# EAGLE schematic OmnibusB (EAGLE 6.6.0), part 2 of 2
## Sheet 4 of 4
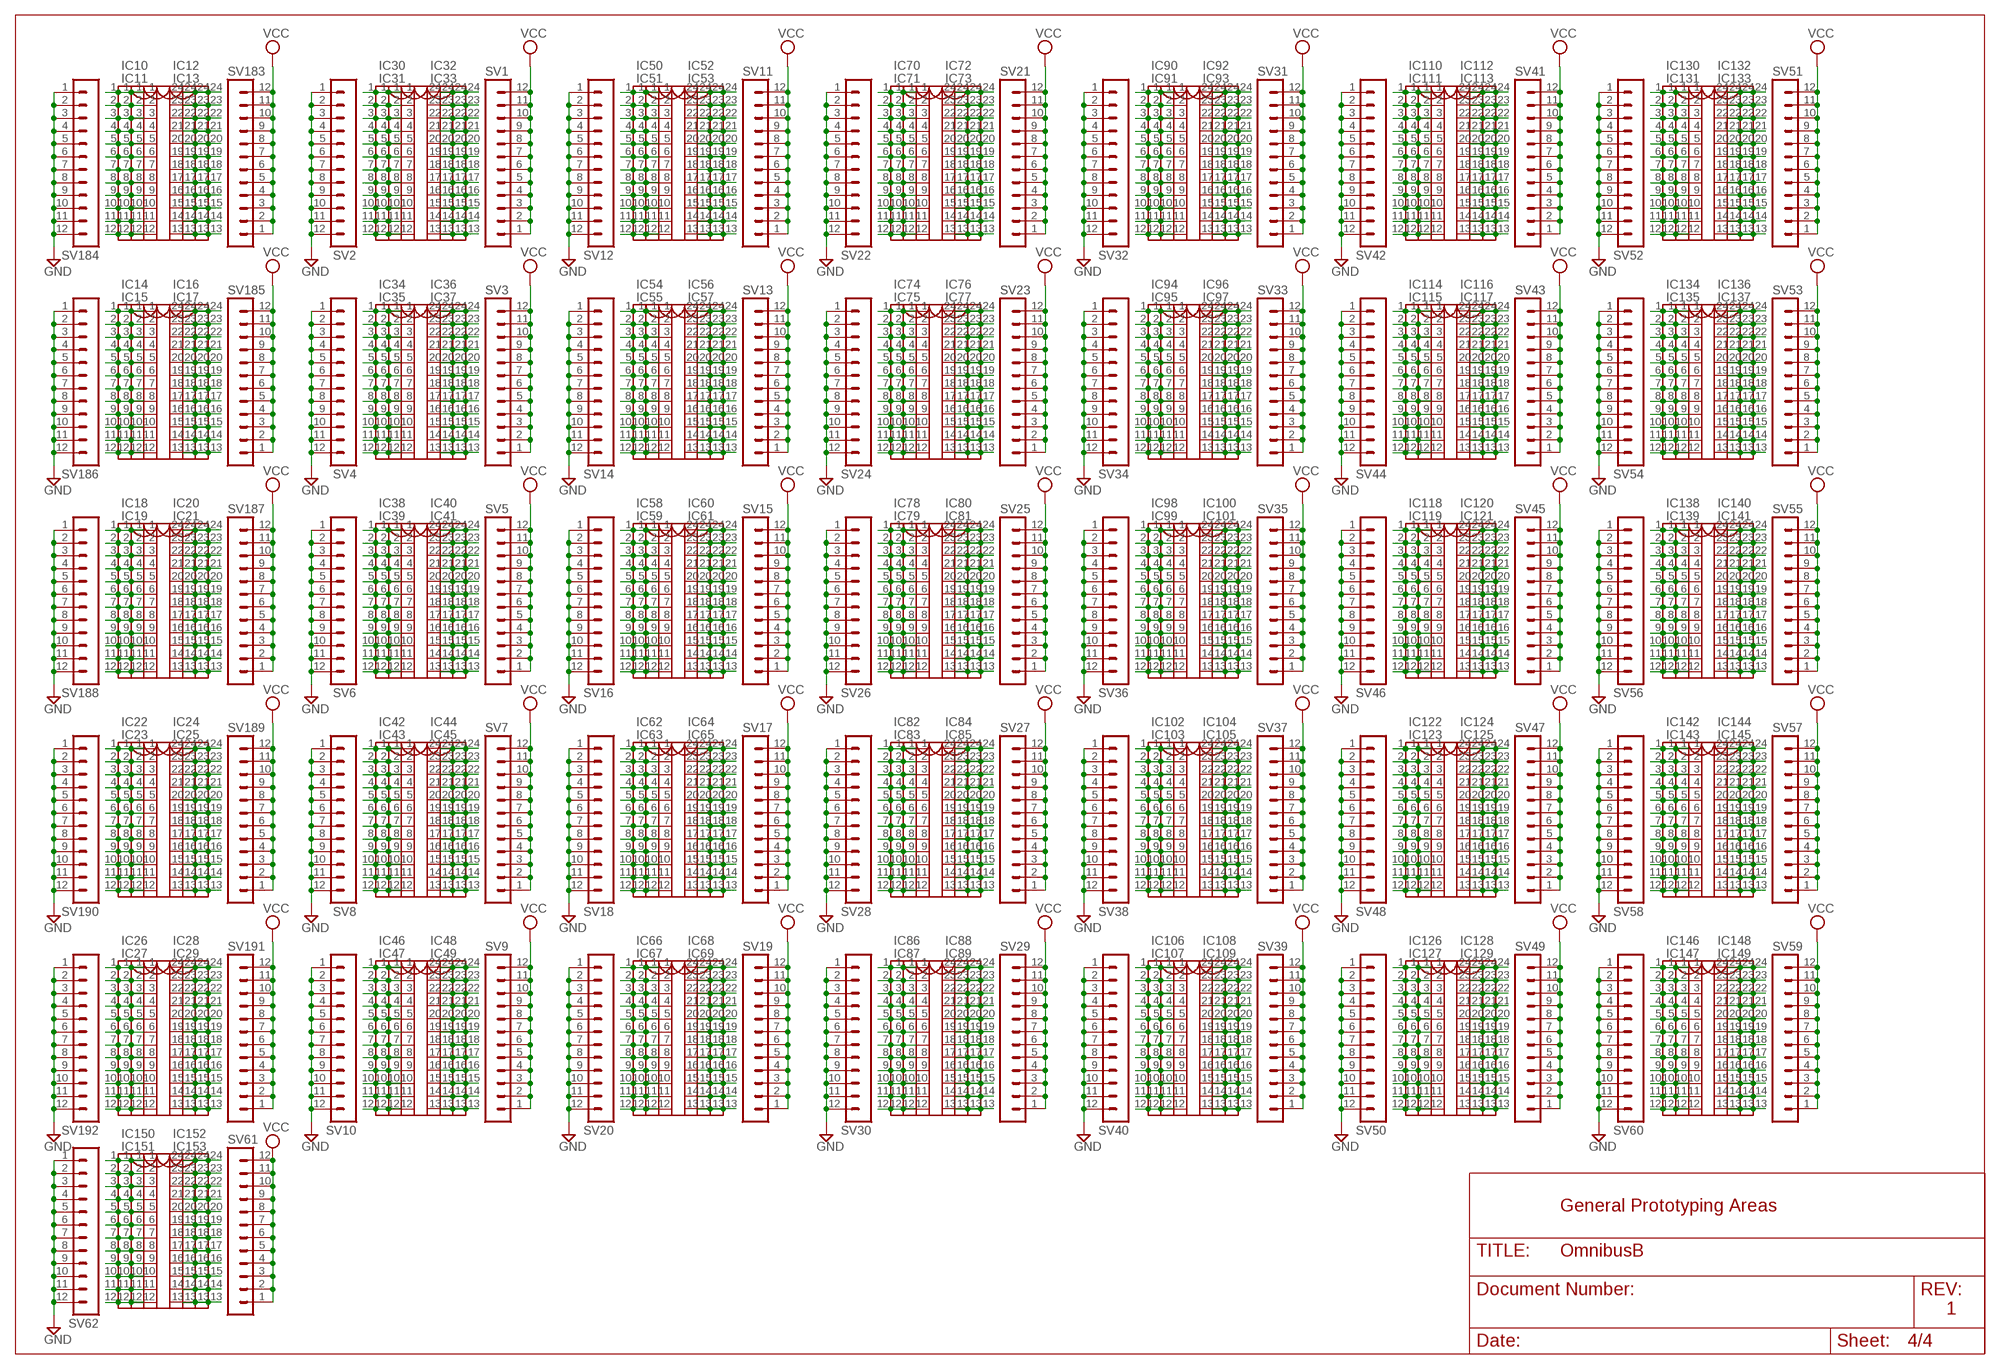
[diagram p3: schematic, sheet 4]

### Parts
IC10  DIL24-3  [DIL24-3]
IC11  DIL24-6  [DIL24-6]
IC12  DIL24-9  [DIL24-9]
IC13  DIL24-6  [DIL24-6]
IC14  DIL24-3  [DIL24-3]
IC15  DIL24-6  [DIL24-6]
IC16  DIL24-9  [DIL24-9]
IC17  DIL24-6  [DIL24-6]
IC18  DIL24-3  [DIL24-3]
IC19  DIL24-6  [DIL24-6]
IC20  DIL24-9  [DIL24-9]
IC21  DIL24-6  [DIL24-6]
IC22  DIL24-3  [DIL24-3]
IC23  DIL24-6  [DIL24-6]
IC24  DIL24-9  [DIL24-9]
IC25  DIL24-6  [DIL24-6]
IC26  DIL24-3  [DIL24-3]
IC27  DIL24-6  [DIL24-6]
IC28  DIL24-9  [DIL24-9]
IC29  DIL24-6  [DIL24-6]
IC30  DIL24-3  [DIL24-3]
IC31  DIL24-6  [DIL24-6]
IC32  DIL24-9  [DIL24-9]
IC33  DIL24-6  [DIL24-6]
IC34  DIL24-3  [DIL24-3]
IC35  DIL24-6  [DIL24-6]
IC36  DIL24-9  [DIL24-9]
IC37  DIL24-6  [DIL24-6]
IC38  DIL24-3  [DIL24-3]
IC39  DIL24-6  [DIL24-6]
IC40  DIL24-9  [DIL24-9]
IC41  DIL24-6  [DIL24-6]
IC42  DIL24-3  [DIL24-3]
IC43  DIL24-6  [DIL24-6]
IC44  DIL24-9  [DIL24-9]
IC45  DIL24-6  [DIL24-6]
IC46  DIL24-3  [DIL24-3]
IC47  DIL24-6  [DIL24-6]
IC48  DIL24-9  [DIL24-9]
IC49  DIL24-6  [DIL24-6]
IC50  DIL24-3  [DIL24-3]
IC51  DIL24-6  [DIL24-6]
IC52  DIL24-9  [DIL24-9]
IC53  DIL24-6  [DIL24-6]
IC54  DIL24-3  [DIL24-3]
IC55  DIL24-6  [DIL24-6]
IC56  DIL24-9  [DIL24-9]
IC57  DIL24-6  [DIL24-6]
IC58  DIL24-3  [DIL24-3]
IC59  DIL24-6  [DIL24-6]
IC60  DIL24-9  [DIL24-9]
IC61  DIL24-6  [DIL24-6]
IC62  DIL24-3  [DIL24-3]
IC63  DIL24-6  [DIL24-6]
IC64  DIL24-9  [DIL24-9]
IC65  DIL24-6  [DIL24-6]
IC66  DIL24-3  [DIL24-3]
IC67  DIL24-6  [DIL24-6]
IC68  DIL24-9  [DIL24-9]
IC69  DIL24-6  [DIL24-6]
IC70  DIL24-3  [DIL24-3]
IC71  DIL24-6  [DIL24-6]
IC72  DIL24-9  [DIL24-9]
IC73  DIL24-6  [DIL24-6]
IC74  DIL24-3  [DIL24-3]
IC75  DIL24-6  [DIL24-6]
IC76  DIL24-9  [DIL24-9]
IC77  DIL24-6  [DIL24-6]
IC78  DIL24-3  [DIL24-3]
IC79  DIL24-6  [DIL24-6]
IC80  DIL24-9  [DIL24-9]
IC81  DIL24-6  [DIL24-6]
IC82  DIL24-3  [DIL24-3]
IC83  DIL24-6  [DIL24-6]
IC84  DIL24-9  [DIL24-9]
IC85  DIL24-6  [DIL24-6]
IC86  DIL24-3  [DIL24-3]
IC87  DIL24-6  [DIL24-6]
IC88  DIL24-9  [DIL24-9]
IC89  DIL24-6  [DIL24-6]
IC90  DIL24-3  [DIL24-3]
IC91  DIL24-6  [DIL24-6]
IC92  DIL24-9  [DIL24-9]
IC93  DIL24-6  [DIL24-6]
IC94  DIL24-3  [DIL24-3]
IC95  DIL24-6  [DIL24-6]
IC96  DIL24-9  [DIL24-9]
IC97  DIL24-6  [DIL24-6]
IC98  DIL24-3  [DIL24-3]
IC99  DIL24-6  [DIL24-6]
IC100  DIL24-9  [DIL24-9]
IC101  DIL24-6  [DIL24-6]
IC102  DIL24-3  [DIL24-3]
IC103  DIL24-6  [DIL24-6]
IC104  DIL24-9  [DIL24-9]
IC105  DIL24-6  [DIL24-6]
IC106  DIL24-3  [DIL24-3]
IC107  DIL24-6  [DIL24-6]
IC108  DIL24-9  [DIL24-9]
IC109  DIL24-6  [DIL24-6]
IC110  DIL24-3  [DIL24-3]
IC111  DIL24-6  [DIL24-6]
IC112  DIL24-9  [DIL24-9]
IC113  DIL24-6  [DIL24-6]
IC114  DIL24-3  [DIL24-3]
IC115  DIL24-6  [DIL24-6]
IC116  DIL24-9  [DIL24-9]
IC117  DIL24-6  [DIL24-6]
IC118  DIL24-3  [DIL24-3]
IC119  DIL24-6  [DIL24-6]
IC120  DIL24-9  [DIL24-9]
IC121  DIL24-6  [DIL24-6]
IC122  DIL24-3  [DIL24-3]
IC123  DIL24-6  [DIL24-6]
IC124  DIL24-9  [DIL24-9]
IC125  DIL24-6  [DIL24-6]
IC126  DIL24-3  [DIL24-3]
IC127  DIL24-6  [DIL24-6]
IC128  DIL24-9  [DIL24-9]
IC129  DIL24-6  [DIL24-6]
IC130  DIL24-3  [DIL24-3]
IC131  DIL24-6  [DIL24-6]
IC132  DIL24-9  [DIL24-9]
IC133  DIL24-6  [DIL24-6]
IC134  DIL24-3  [DIL24-3]
IC135  DIL24-6  [DIL24-6]
IC136  DIL24-9  [DIL24-9]
IC137  DIL24-6  [DIL24-6]
IC138  DIL24-3  [DIL24-3]
IC139  DIL24-6  [DIL24-6]
IC140  DIL24-9  [DIL24-9]
IC141  DIL24-6  [DIL24-6]
IC142  DIL24-3  [DIL24-3]
IC143  DIL24-6  [DIL24-6]
IC144  DIL24-9  [DIL24-9]
IC145  DIL24-6  [DIL24-6]
IC146  DIL24-3  [DIL24-3]
IC147  DIL24-6  [DIL24-6]
IC148  DIL24-9  [DIL24-9]
IC149  DIL24-6  [DIL24-6]
IC150  DIL24-3  [DIL24-3]
IC151  DIL24-6  [DIL24-6]
IC152  DIL24-9  [DIL24-9]
IC153  DIL24-6  [DIL24-6]
SV1  MA12-1  [MA12-1]
SV2  MA12-1  [MA12-1]
SV3  MA12-1  [MA12-1]
SV4  MA12-1  [MA12-1]
SV5  MA12-1  [MA12-1]
SV6  MA12-1  [MA12-1]
SV7  MA12-1  [MA12-1]
SV8  MA12-1  [MA12-1]
SV9  MA12-1  [MA12-1]
SV10  MA12-1  [MA12-1]
SV11  MA12-1  [MA12-1]
SV12  MA12-1  [MA12-1]
SV13  MA12-1  [MA12-1]
SV14  MA12-1  [MA12-1]
SV15  MA12-1  [MA12-1]
SV16  MA12-1  [MA12-1]
SV17  MA12-1  [MA12-1]
SV18  MA12-1  [MA12-1]
SV19  MA12-1  [MA12-1]
SV20  MA12-1  [MA12-1]
SV21  MA12-1  [MA12-1]
SV22  MA12-1  [MA12-1]
SV23  MA12-1  [MA12-1]
SV24  MA12-1  [MA12-1]
SV25  MA12-1  [MA12-1]
SV26  MA12-1  [MA12-1]
SV27  MA12-1  [MA12-1]
SV28  MA12-1  [MA12-1]
SV29  MA12-1  [MA12-1]
SV30  MA12-1  [MA12-1]
SV31  MA12-1  [MA12-1]
SV32  MA12-1  [MA12-1]
SV33  MA12-1  [MA12-1]
SV34  MA12-1  [MA12-1]
SV35  MA12-1  [MA12-1]
SV36  MA12-1  [MA12-1]
SV37  MA12-1  [MA12-1]
SV38  MA12-1  [MA12-1]
SV39  MA12-1  [MA12-1]
SV40  MA12-1  [MA12-1]
SV41  MA12-1  [MA12-1]
SV42  MA12-1  [MA12-1]
SV43  MA12-1  [MA12-1]
SV44  MA12-1  [MA12-1]
SV45  MA12-1  [MA12-1]
SV46  MA12-1  [MA12-1]
SV47  MA12-1  [MA12-1]
SV48  MA12-1  [MA12-1]
SV49  MA12-1  [MA12-1]
SV50  MA12-1  [MA12-1]
SV51  MA12-1  [MA12-1]
SV52  MA12-1  [MA12-1]
SV53  MA12-1  [MA12-1]
SV54  MA12-1  [MA12-1]
SV55  MA12-1  [MA12-1]
SV56  MA12-1  [MA12-1]
SV57  MA12-1  [MA12-1]
SV58  MA12-1  [MA12-1]
SV59  MA12-1  [MA12-1]
SV60  MA12-1  [MA12-1]
SV61  MA12-1  [MA12-1]
SV62  MA12-1  [MA12-1]
SV183  MA12-1  [MA12-1]
SV184  MA12-1  [MA12-1]
SV185  MA12-1  [MA12-1]
SV186  MA12-1  [MA12-1]
SV187  MA12-1  [MA12-1]
SV188  MA12-1  [MA12-1]
SV189  MA12-1  [MA12-1]
SV190  MA12-1  [MA12-1]
SV191  MA12-1  [MA12-1]
SV192  MA12-1  [MA12-1]

### Nets
GND [supply]: SV2.1 SV2.2 SV2.3 SV2.4 SV2.5 SV2.6 SV2.7 SV2.8 SV2.9 SV2.10 SV2.11 SV2.12 SV4.1 SV4.2 SV4.3 SV4.4 SV4.5 SV4.6 SV4.7 SV4.8 SV4.9 SV4.10 SV4.11 SV4.12 SV6.1 SV6.2 SV6.3 SV6.4 SV6.5 SV6.6 SV6.7 SV6.8 SV6.9 SV6.10 SV6.11 SV6.12 SV8.1 SV8.2 SV8.3 SV8.4 SV8.5 SV8.6 SV8.7 SV8.8 SV8.9 SV8.10 SV8.11 SV8.12 SV10.1 SV10.2 SV10.3 SV10.4 SV10.5 SV10.6 SV10.7 SV10.8 SV10.9 SV10.10 SV10.11 SV10.12 SV12.1 SV12.2 SV12.3 SV12.4 SV12.5 SV12.6 SV12.7 SV12.8 SV12.9 SV12.10 SV12.11 SV12.12 SV14.1 SV14.2 SV14.3 SV14.4 SV14.5 SV14.6 SV14.7 SV14.8 SV14.9 SV14.10 SV14.11 SV14.12 SV16.1 SV16.2 SV16.3 SV16.4 SV16.5 SV16.6 SV16.7 SV16.8 SV16.9 SV16.10 SV16.11 SV16.12 SV18.1 SV18.2 SV18.3 SV18.4 SV18.5 SV18.6 SV18.7 SV18.8 SV18.9 SV18.10 SV18.11 SV18.12 SV20.1 SV20.2 SV20.3 SV20.4 SV20.5 SV20.6 SV20.7 SV20.8 SV20.9 SV20.10 SV20.11 SV20.12 SV22.1 SV22.2 SV22.3 SV22.4 SV22.5 SV22.6 SV22.7 SV22.8 SV22.9 SV22.10 SV22.11 SV22.12 SV24.1 SV24.2 SV24.3 SV24.4 SV24.5 SV24.6 SV24.7 SV24.8 SV24.9 SV24.10 SV24.11 SV24.12 SV26.1 SV26.2 SV26.3 SV26.4 SV26.5 SV26.6 SV26.7 SV26.8 SV26.9 SV26.10 SV26.11 SV26.12 SV28.1 SV28.2 SV28.3 SV28.4 SV28.5 SV28.6 SV28.7 SV28.8 SV28.9 SV28.10 SV28.11 SV28.12 SV30.1 SV30.2 SV30.3 SV30.4 SV30.5 SV30.6 SV30.7 SV30.8 SV30.9 SV30.10 SV30.11 SV30.12 SV32.1 SV32.2 SV32.3 SV32.4 SV32.5 SV32.6 SV32.7 SV32.8 SV32.9 SV32.10 SV32.11 SV32.12 SV34.1 SV34.2 SV34.3 SV34.4 SV34.5 SV34.6 SV34.7 SV34.8 SV34.9 SV34.10 SV34.11 SV34.12 SV36.1 SV36.2 SV36.3 SV36.4 SV36.5 SV36.6 SV36.7 SV36.8 SV36.9 SV36.10 SV36.11 SV36.12 SV38.1 SV38.2 SV38.3 SV38.4 SV38.5 SV38.6 SV38.7 SV38.8 SV38.9 SV38.10 SV38.11 SV38.12 SV40.1 SV40.2 SV40.3 SV40.4 SV40.5 SV40.6 SV40.7 SV40.8 SV40.9 SV40.10 SV40.11 SV40.12 SV42.1 SV42.2 SV42.3 SV42.4 SV42.5 SV42.6 SV42.7 SV42.8 SV42.9 SV42.10 SV42.11 SV42.12 SV44.1 SV44.2 SV44.3 SV44.4 SV44.5 SV44.6 SV44.7 SV44.8 SV44.9 SV44.10 SV44.11 SV44.12 SV46.1 SV46.2 SV46.3 SV46.4 SV46.5 SV46.6 SV46.7 SV46.8 SV46.9 SV46.10 SV46.11 SV46.12 SV48.1 SV48.2 SV48.3 SV48.4 SV48.5 SV48.6 SV48.7 SV48.8 SV48.9 SV48.10 SV48.11 SV48.12 SV50.1 SV50.2 SV50.3 SV50.4 SV50.5 SV50.6 SV50.7 SV50.8 SV50.9 SV50.10 SV50.11 SV50.12 SV52.1 SV52.2 SV52.3 SV52.4 SV52.5 SV52.6 SV52.7 SV52.8 SV52.9 SV52.10 SV52.11 SV52.12 SV54.1 SV54.2 SV54.3 SV54.4 SV54.5 SV54.6 SV54.7 SV54.8 SV54.9 SV54.10 SV54.11 SV54.12 SV56.1 SV56.2 SV56.3 SV56.4 SV56.5 SV56.6 SV56.7 SV56.8 SV56.9 SV56.10 SV56.11 SV56.12 SV58.1 SV58.2 SV58.3 SV58.4 SV58.5 SV58.6 SV58.7 SV58.8 SV58.9 SV58.10 SV58.11 SV58.12 SV60.1 SV60.2 SV60.3 SV60.4 SV60.5 SV60.6 SV60.7 SV60.8 SV60.9 SV60.10 SV60.11 SV60.12 SV62.1 SV62.2 SV62.3 SV62.4 SV62.5 SV62.6 SV62.7 SV62.8 SV62.9 SV62.10 SV62.11 SV62.12 SV184.1 SV184.2 SV184.3 SV184.4 SV184.5 SV184.6 SV184.7 SV184.8 SV184.9 SV184.10 SV184.11 SV184.12 SV186.1 SV186.2 SV186.3 SV186.4 SV186.5 SV186.6 SV186.7 SV186.8 SV186.9 SV186.10 SV186.11 SV186.12 SV188.1 SV188.2 SV188.3 SV188.4 SV188.5 SV188.6 SV188.7 SV188.8 SV188.9 SV188.10 SV188.11 SV188.12 SV190.1 SV190.2 SV190.3 SV190.4 SV190.5 SV190.6 SV190.7 SV190.8 SV190.9 SV190.10 SV190.11 SV190.12 SV192.1 SV192.2 SV192.3 SV192.4 SV192.5 SV192.6 SV192.7 SV192.8 SV192.9 SV192.10 SV192.11 SV192.12 ; also sheet 1,2,3
N$34: IC30.1 IC31.1 IC32.1 IC33.1
N$40: IC30.2 IC31.2 IC32.2 IC33.2
N$41: IC30.3 IC31.3 IC32.3 IC33.3
N$42: IC30.4 IC31.4 IC32.4 IC33.4
N$43: IC30.5 IC31.5 IC32.5 IC33.5
N$44: IC30.6 IC31.6 IC32.6 IC33.6
N$45: IC30.7 IC31.7 IC32.7 IC33.7
N$55: IC10.1 IC11.1 IC12.1 IC13.1
N$56: IC10.2 IC11.2 IC12.2 IC13.2
N$57: IC10.3 IC11.3 IC12.3 IC13.3
N$58: IC10.4 IC11.4 IC12.4 IC13.4
N$59: IC10.5 IC11.5 IC12.5 IC13.5
N$60: IC10.6 IC11.6 IC12.6 IC13.6
N$61: IC10.7 IC11.7 IC12.7 IC13.7
N$62: IC10.8 IC11.8 IC12.8 IC13.8
N$63: IC10.9 IC11.9 IC12.9 IC13.9
N$64: IC10.10 IC11.10 IC12.10 IC13.10
N$65: IC10.11 IC11.11 IC12.11 IC13.11
N$66: IC10.12 IC11.12 IC12.12 IC13.12
N$67: IC10.13 IC11.13 IC12.13 IC13.13
N$68: IC10.14 IC11.14 IC12.14 IC13.14
N$69: IC10.15 IC11.15 IC12.15 IC13.15
N$70: IC10.16 IC11.16 IC12.16 IC13.16
N$71: IC10.17 IC11.17 IC12.17 IC13.17
N$72: IC10.18 IC11.18 IC12.18 IC13.18
N$73: IC10.19 IC11.19 IC12.19 IC13.19
N$74: IC10.20 IC11.20 IC12.20 IC13.20
N$75: IC10.21 IC11.21 IC12.21 IC13.21
N$76: IC10.22 IC11.22 IC12.22 IC13.22
N$77: IC10.23 IC11.23 IC12.23 IC13.23
N$78: IC10.24 IC11.24 IC12.24 IC13.24
N$79: IC14.1 IC15.1 IC16.1 IC17.1
N$80: IC14.2 IC15.2 IC16.2 IC17.2
N$81: IC14.3 IC15.3 IC16.3 IC17.3
N$82: IC14.4 IC15.4 IC16.4 IC17.4
N$83: IC14.5 IC15.5 IC16.5 IC17.5
N$84: IC14.6 IC15.6 IC16.6 IC17.6
N$85: IC14.7 IC15.7 IC16.7 IC17.7
N$86: IC14.8 IC15.8 IC16.8 IC17.8
N$87: IC14.9 IC15.9 IC16.9 IC17.9
N$88: IC14.10 IC15.10 IC16.10 IC17.10
N$89: IC14.11 IC15.11 IC16.11 IC17.11
N$90: IC14.12 IC15.12 IC16.12 IC17.12
N$91: IC14.13 IC15.13 IC16.13 IC17.13
N$92: IC14.14 IC15.14 IC16.14 IC17.14
N$93: IC14.15 IC15.15 IC16.15 IC17.15
N$94: IC14.16 IC15.16 IC16.16 IC17.16
N$95: IC14.17 IC15.17 IC16.17 IC17.17
N$96: IC14.18 IC15.18 IC16.18 IC17.18
N$97: IC14.19 IC15.19 IC16.19 IC17.19
N$98: IC14.20 IC15.20 IC16.20 IC17.20
N$99: IC14.21 IC15.21 IC16.21 IC17.21
N$100: IC14.22 IC15.22 IC16.22 IC17.22
N$101: IC14.23 IC15.23 IC16.23 IC17.23
N$102: IC14.24 IC15.24 IC16.24 IC17.24
N$103: IC18.1 IC19.1 IC20.1 IC21.1
N$104: IC18.2 IC19.2 IC20.2 IC21.2
N$105: IC18.3 IC19.3 IC20.3 IC21.3
N$106: IC18.4 IC19.4 IC20.4 IC21.4
N$107: IC18.5 IC19.5 IC20.5 IC21.5
N$108: IC18.6 IC19.6 IC20.6 IC21.6
N$109: IC18.7 IC19.7 IC20.7 IC21.7
N$110: IC18.8 IC19.8 IC20.8 IC21.8
N$111: IC18.9 IC19.9 IC20.9 IC21.9
N$112: IC18.10 IC19.10 IC20.10 IC21.10
N$113: IC18.11 IC19.11 IC20.11 IC21.11
N$114: IC18.12 IC19.12 IC20.12 IC21.12
N$115: IC18.13 IC19.13 IC20.13 IC21.13
N$116: IC18.14 IC19.14 IC20.14 IC21.14
N$117: IC18.15 IC19.15 IC20.15 IC21.15
N$118: IC18.16 IC19.16 IC20.16 IC21.16
N$119: IC18.17 IC19.17 IC20.17 IC21.17
N$120: IC18.18 IC19.18 IC20.18 IC21.18
N$121: IC18.19 IC19.19 IC20.19 IC21.19
N$122: IC18.20 IC19.20 IC20.20 IC21.20
N$123: IC18.21 IC19.21 IC20.21 IC21.21
N$124: IC18.22 IC19.22 IC20.22 IC21.22
N$125: IC18.23 IC19.23 IC20.23 IC21.23
N$126: IC18.24 IC19.24 IC20.24 IC21.24
N$127: IC22.1 IC23.1 IC24.1 IC25.1
N$128: IC22.2 IC23.2 IC24.2 IC25.2
N$129: IC22.3 IC23.3 IC24.3 IC25.3
N$130: IC22.4 IC23.4 IC24.4 IC25.4
N$131: IC22.5 IC23.5 IC24.5 IC25.5
N$132: IC22.6 IC23.6 IC24.6 IC25.6
N$133: IC22.7 IC23.7 IC24.7 IC25.7
N$134: IC22.8 IC23.8 IC24.8 IC25.8
N$135: IC22.9 IC23.9 IC24.9 IC25.9
N$136: IC22.10 IC23.10 IC24.10 IC25.10
N$137: IC22.11 IC23.11 IC24.11 IC25.11
N$138: IC22.12 IC23.12 IC24.12 IC25.12
N$139: IC22.13 IC23.13 IC24.13 IC25.13
N$140: IC22.14 IC23.14 IC24.14 IC25.14
N$141: IC22.15 IC23.15 IC24.15 IC25.15
N$142: IC22.16 IC23.16 IC24.16 IC25.16
N$143: IC22.17 IC23.17 IC24.17 IC25.17
N$144: IC22.18 IC23.18 IC24.18 IC25.18
N$145: IC22.19 IC23.19 IC24.19 IC25.19
N$146: IC22.20 IC23.20 IC24.20 IC25.20
N$147: IC22.21 IC23.21 IC24.21 IC25.21
N$148: IC22.22 IC23.22 IC24.22 IC25.22
N$149: IC22.23 IC23.23 IC24.23 IC25.23
N$150: IC22.24 IC23.24 IC24.24 IC25.24
N$151: IC26.1 IC27.1 IC28.1 IC29.1
N$152: IC26.2 IC27.2 IC28.2 IC29.2
N$153: IC26.3 IC27.3 IC28.3 IC29.3
N$154: IC26.4 IC27.4 IC28.4 IC29.4
N$155: IC26.5 IC27.5 IC28.5 IC29.5
N$156: IC26.6 IC27.6 IC28.6 IC29.6
N$157: IC26.7 IC27.7 IC28.7 IC29.7
N$158: IC26.8 IC27.8 IC28.8 IC29.8
N$159: IC26.9 IC27.9 IC28.9 IC29.9
N$160: IC26.10 IC27.10 IC28.10 IC29.10
N$161: IC26.11 IC27.11 IC28.11 IC29.11
N$162: IC26.12 IC27.12 IC28.12 IC29.12
N$163: IC26.13 IC27.13 IC28.13 IC29.13
N$164: IC26.14 IC27.14 IC28.14 IC29.14
N$165: IC26.15 IC27.15 IC28.15 IC29.15
N$166: IC26.16 IC27.16 IC28.16 IC29.16
N$167: IC26.17 IC27.17 IC28.17 IC29.17
N$168: IC26.18 IC27.18 IC28.18 IC29.18
N$169: IC26.19 IC27.19 IC28.19 IC29.19
N$170: IC26.20 IC27.20 IC28.20 IC29.20
N$171: IC26.21 IC27.21 IC28.21 IC29.21
N$172: IC26.22 IC27.22 IC28.22 IC29.22
N$173: IC26.23 IC27.23 IC28.23 IC29.23
N$174: IC26.24 IC27.24 IC28.24 IC29.24
N$175: IC30.8 IC31.8 IC32.8 IC33.8
N$176: IC30.9 IC31.9 IC32.9 IC33.9
N$177: IC30.10 IC31.10 IC32.10 IC33.10
N$178: IC30.11 IC31.11 IC32.11 IC33.11
N$179: IC30.12 IC31.12 IC32.12 IC33.12
N$180: IC30.13 IC31.13 IC32.13 IC33.13
N$181: IC30.14 IC31.14 IC32.14 IC33.14
N$182: IC30.15 IC31.15 IC32.15 IC33.15
N$183: IC30.16 IC31.16 IC32.16 IC33.16
N$184: IC30.17 IC31.17 IC32.17 IC33.17
N$185: IC30.18 IC31.18 IC32.18 IC33.18
N$186: IC30.19 IC31.19 IC32.19 IC33.19
N$187: IC30.20 IC31.20 IC32.20 IC33.20
N$188: IC30.21 IC31.21 IC32.21 IC33.21
N$189: IC30.22 IC31.22 IC32.22 IC33.22
N$190: IC30.23 IC31.23 IC32.23 IC33.23
N$191: IC30.24 IC31.24 IC32.24 IC33.24
N$192: IC34.1 IC35.1 IC36.1 IC37.1
N$193: IC34.2 IC35.2 IC36.2 IC37.2
N$194: IC34.3 IC35.3 IC36.3 IC37.3
N$195: IC34.4 IC35.4 IC36.4 IC37.4
N$196: IC34.5 IC35.5 IC36.5 IC37.5
N$197: IC34.6 IC35.6 IC36.6 IC37.6
N$198: IC34.7 IC35.7 IC36.7 IC37.7
N$199: IC34.8 IC35.8 IC36.8 IC37.8
N$200: IC34.9 IC35.9 IC36.9 IC37.9
N$201: IC34.10 IC35.10 IC36.10 IC37.10
N$202: IC34.11 IC35.11 IC36.11 IC37.11
N$203: IC34.12 IC35.12 IC36.12 IC37.12
N$204: IC34.13 IC35.13 IC36.13 IC37.13
N$205: IC34.14 IC35.14 IC36.14 IC37.14
N$206: IC34.15 IC35.15 IC36.15 IC37.15
N$207: IC34.16 IC35.16 IC36.16 IC37.16
N$208: IC34.17 IC35.17 IC36.17 IC37.17
N$209: IC34.18 IC35.18 IC36.18 IC37.18
N$210: IC34.19 IC35.19 IC36.19 IC37.19
N$211: IC34.20 IC35.20 IC36.20 IC37.20
N$212: IC34.21 IC35.21 IC36.21 IC37.21
N$213: IC34.22 IC35.22 IC36.22 IC37.22
N$214: IC34.23 IC35.23 IC36.23 IC37.23
N$215: IC34.24 IC35.24 IC36.24 IC37.24
N$216: IC38.1 IC39.1 IC40.1 IC41.1
N$217: IC38.2 IC39.2 IC40.2 IC41.2
N$218: IC38.3 IC39.3 IC40.3 IC41.3
N$219: IC38.4 IC39.4 IC40.4 IC41.4
N$220: IC38.5 IC39.5 IC40.5 IC41.5
N$221: IC38.6 IC39.6 IC40.6 IC41.6
N$222: IC38.7 IC39.7 IC40.7 IC41.7
N$223: IC38.8 IC39.8 IC40.8 IC41.8
N$224: IC38.9 IC39.9 IC40.9 IC41.9
N$225: IC38.10 IC39.10 IC40.10 IC41.10
N$226: IC38.11 IC39.11 IC40.11 IC41.11
N$227: IC38.12 IC39.12 IC40.12 IC41.12
N$228: IC38.13 IC39.13 IC40.13 IC41.13
N$229: IC38.14 IC39.14 IC40.14 IC41.14
N$230: IC38.15 IC39.15 IC40.15 IC41.15
N$231: IC38.16 IC39.16 IC40.16 IC41.16
N$232: IC38.17 IC39.17 IC40.17 IC41.17
N$233: IC38.18 IC39.18 IC40.18 IC41.18
N$234: IC38.19 IC39.19 IC40.19 IC41.19
N$235: IC38.20 IC39.20 IC40.20 IC41.20
N$236: IC38.21 IC39.21 IC40.21 IC41.21
N$237: IC38.22 IC39.22 IC40.22 IC41.22
N$238: IC38.23 IC39.23 IC40.23 IC41.23
N$239: IC38.24 IC39.24 IC40.24 IC41.24
N$240: IC42.1 IC43.1 IC44.1 IC45.1
N$241: IC42.2 IC43.2 IC44.2 IC45.2
N$242: IC42.3 IC43.3 IC44.3 IC45.3
N$243: IC42.4 IC43.4 IC44.4 IC45.4
N$244: IC42.5 IC43.5 IC44.5 IC45.5
N$245: IC42.6 IC43.6 IC44.6 IC45.6
N$246: IC42.7 IC43.7 IC44.7 IC45.7
N$247: IC42.8 IC43.8 IC44.8 IC45.8
N$248: IC42.9 IC43.9 IC44.9 IC45.9
N$249: IC42.10 IC43.10 IC44.10 IC45.10
N$250: IC42.11 IC43.11 IC44.11 IC45.11
N$251: IC42.12 IC43.12 IC44.12 IC45.12
N$252: IC42.13 IC43.13 IC44.13 IC45.13
N$253: IC42.14 IC43.14 IC44.14 IC45.14
N$254: IC42.15 IC43.15 IC44.15 IC45.15
N$255: IC42.16 IC43.16 IC44.16 IC45.16
N$256: IC42.17 IC43.17 IC44.17 IC45.17
N$257: IC42.18 IC43.18 IC44.18 IC45.18
N$258: IC42.19 IC43.19 IC44.19 IC45.19
N$259: IC42.20 IC43.20 IC44.20 IC45.20
N$260: IC42.21 IC43.21 IC44.21 IC45.21
N$261: IC42.22 IC43.22 IC44.22 IC45.22
N$262: IC42.23 IC43.23 IC44.23 IC45.23
N$263: IC42.24 IC43.24 IC44.24 IC45.24
N$264: IC46.1 IC47.1 IC48.1 IC49.1
N$265: IC46.2 IC47.2 IC48.2 IC49.2
N$266: IC46.3 IC47.3 IC48.3 IC49.3
N$267: IC46.4 IC47.4 IC48.4 IC49.4
N$268: IC46.5 IC47.5 IC48.5 IC49.5
N$269: IC46.6 IC47.6 IC48.6 IC49.6
N$270: IC46.7 IC47.7 IC48.7 IC49.7
N$271: IC46.8 IC47.8 IC48.8 IC49.8
N$272: IC46.9 IC47.9 IC48.9 IC49.9
N$273: IC46.10 IC47.10 IC48.10 IC49.10
N$274: IC46.11 IC47.11 IC48.11 IC49.11
N$275: IC46.12 IC47.12 IC48.12 IC49.12
N$276: IC46.13 IC47.13 IC48.13 IC49.13
N$277: IC46.14 IC47.14 IC48.14 IC49.14
N$278: IC46.15 IC47.15 IC48.15 IC49.15
N$279: IC46.16 IC47.16 IC48.16 IC49.16
N$280: IC46.17 IC47.17 IC48.17 IC49.17
N$281: IC46.18 IC47.18 IC48.18 IC49.18
N$282: IC46.19 IC47.19 IC48.19 IC49.19
N$283: IC46.20 IC47.20 IC48.20 IC49.20
N$284: IC46.21 IC47.21 IC48.21 IC49.21
N$285: IC46.22 IC47.22 IC48.22 IC49.22
N$286: IC46.23 IC47.23 IC48.23 IC49.23
N$287: IC46.24 IC47.24 IC48.24 IC49.24
N$288: IC50.1 IC51.1 IC52.1 IC53.1
N$289: IC50.2 IC51.2 IC52.2 IC53.2
N$290: IC50.3 IC51.3 IC52.3 IC53.3
N$291: IC50.4 IC51.4 IC52.4 IC53.4
N$292: IC50.5 IC51.5 IC52.5 IC53.5
N$293: IC50.6 IC51.6 IC52.6 IC53.6
N$294: IC50.7 IC51.7 IC52.7 IC53.7
N$295: IC50.8 IC51.8 IC52.8 IC53.8
N$296: IC50.9 IC51.9 IC52.9 IC53.9
N$297: IC50.10 IC51.10 IC52.10 IC53.10
N$298: IC50.11 IC51.11 IC52.11 IC53.11
N$299: IC50.12 IC51.12 IC52.12 IC53.12
N$300: IC50.13 IC51.13 IC52.13 IC53.13
N$301: IC50.14 IC51.14 IC52.14 IC53.14
N$302: IC50.15 IC51.15 IC52.15 IC53.15
N$303: IC50.16 IC51.16 IC52.16 IC53.16
N$304: IC50.17 IC51.17 IC52.17 IC53.17
N$305: IC50.18 IC51.18 IC52.18 IC53.18
N$306: IC50.19 IC51.19 IC52.19 IC53.19
N$307: IC50.20 IC51.20 IC52.20 IC53.20
N$308: IC50.21 IC51.21 IC52.21 IC53.21
N$309: IC50.22 IC51.22 IC52.22 IC53.22
N$310: IC50.23 IC51.23 IC52.23 IC53.23
N$311: IC50.24 IC51.24 IC52.24 IC53.24
N$312: IC54.1 IC55.1 IC56.1 IC57.1
N$313: IC54.2 IC55.2 IC56.2 IC57.2
N$314: IC54.3 IC55.3 IC56.3 IC57.3
N$315: IC54.4 IC55.4 IC56.4 IC57.4
N$316: IC54.5 IC55.5 IC56.5 IC57.5
N$317: IC54.6 IC55.6 IC56.6 IC57.6
N$318: IC54.7 IC55.7 IC56.7 IC57.7
N$319: IC54.8 IC55.8 IC56.8 IC57.8
N$320: IC54.9 IC55.9 IC56.9 IC57.9
N$321: IC54.10 IC55.10 IC56.10 IC57.10
N$322: IC54.11 IC55.11 IC56.11 IC57.11
N$323: IC54.12 IC55.12 IC56.12 IC57.12
N$324: IC54.13 IC55.13 IC56.13 IC57.13
N$325: IC54.14 IC55.14 IC56.14 IC57.14
N$326: IC54.15 IC55.15 IC56.15 IC57.15
N$327: IC54.16 IC55.16 IC56.16 IC57.16
N$328: IC54.17 IC55.17 IC56.17 IC57.17
N$329: IC54.18 IC55.18 IC56.18 IC57.18
N$330: IC54.19 IC55.19 IC56.19 IC57.19
N$331: IC54.20 IC55.20 IC56.20 IC57.20
N$332: IC54.21 IC55.21 IC56.21 IC57.21
N$333: IC54.22 IC55.22 IC56.22 IC57.22
N$334: IC54.23 IC55.23 IC56.23 IC57.23
N$335: IC54.24 IC55.24 IC56.24 IC57.24
N$336: IC58.1 IC59.1 IC60.1 IC61.1
N$337: IC58.2 IC59.2 IC60.2 IC61.2
N$338: IC58.3 IC59.3 IC60.3 IC61.3
N$339: IC58.4 IC59.4 IC60.4 IC61.4
N$340: IC58.5 IC59.5 IC60.5 IC61.5
N$341: IC58.6 IC59.6 IC60.6 IC61.6
N$342: IC58.7 IC59.7 IC60.7 IC61.7
N$343: IC58.8 IC59.8 IC60.8 IC61.8
N$344: IC58.9 IC59.9 IC60.9 IC61.9
N$345: IC58.10 IC59.10 IC60.10 IC61.10
N$346: IC58.11 IC59.11 IC60.11 IC61.11
N$347: IC58.12 IC59.12 IC60.12 IC61.12
N$348: IC58.13 IC59.13 IC60.13 IC61.13
N$349: IC58.14 IC59.14 IC60.14 IC61.14
N$350: IC58.15 IC59.15 IC60.15 IC61.15
N$351: IC58.16 IC59.16 IC60.16 IC61.16
N$352: IC58.17 IC59.17 IC60.17 IC61.17
N$353: IC58.18 IC59.18 IC60.18 IC61.18
N$354: IC58.19 IC59.19 IC60.19 IC61.19
N$355: IC58.20 IC59.20 IC60.20 IC61.20
N$356: IC58.21 IC59.21 IC60.21 IC61.21
N$357: IC58.22 IC59.22 IC60.22 IC61.22
N$358: IC58.23 IC59.23 IC60.23 IC61.23
N$359: IC58.24 IC59.24 IC60.24 IC61.24
N$360: IC62.1 IC63.1 IC64.1 IC65.1
N$361: IC62.2 IC63.2 IC64.2 IC65.2
N$362: IC62.3 IC63.3 IC64.3 IC65.3
N$363: IC62.4 IC63.4 IC64.4 IC65.4
N$364: IC62.5 IC63.5 IC64.5 IC65.5
N$365: IC62.6 IC63.6 IC64.6 IC65.6
N$366: IC62.7 IC63.7 IC64.7 IC65.7
N$367: IC62.8 IC63.8 IC64.8 IC65.8
N$368: IC62.9 IC63.9 IC64.9 IC65.9
N$369: IC62.10 IC63.10 IC64.10 IC65.10
N$370: IC62.11 IC63.11 IC64.11 IC65.11
N$371: IC62.12 IC63.12 IC64.12 IC65.12
N$372: IC62.13 IC63.13 IC64.13 IC65.13
N$373: IC62.14 IC63.14 IC64.14 IC65.14
N$374: IC62.15 IC63.15 IC64.15 IC65.15
N$375: IC62.16 IC63.16 IC64.16 IC65.16
N$376: IC62.17 IC63.17 IC64.17 IC65.17
N$377: IC62.18 IC63.18 IC64.18 IC65.18
N$378: IC62.19 IC63.19 IC64.19 IC65.19
N$379: IC62.20 IC63.20 IC64.20 IC65.20
N$380: IC62.21 IC63.21 IC64.21 IC65.21
N$381: IC62.22 IC63.22 IC64.22 IC65.22
N$382: IC62.23 IC63.23 IC64.23 IC65.23
N$383: IC62.24 IC63.24 IC64.24 IC65.24
N$384: IC66.1 IC67.1 IC68.1 IC69.1
N$385: IC66.2 IC67.2 IC68.2 IC69.2
N$386: IC66.3 IC67.3 IC68.3 IC69.3
N$387: IC66.4 IC67.4 IC68.4 IC69.4
N$388: IC66.5 IC67.5 IC68.5 IC69.5
N$389: IC66.6 IC67.6 IC68.6 IC69.6
N$390: IC66.7 IC67.7 IC68.7 IC69.7
N$391: IC66.8 IC67.8 IC68.8 IC69.8
N$392: IC66.9 IC67.9 IC68.9 IC69.9
N$393: IC66.10 IC67.10 IC68.10 IC69.10
N$394: IC66.11 IC67.11 IC68.11 IC69.11
N$395: IC66.12 IC67.12 IC68.12 IC69.12
N$396: IC66.13 IC67.13 IC68.13 IC69.13
N$397: IC66.14 IC67.14 IC68.14 IC69.14
N$398: IC66.15 IC67.15 IC68.15 IC69.15
N$399: IC66.16 IC67.16 IC68.16 IC69.16
N$400: IC66.17 IC67.17 IC68.17 IC69.17
N$401: IC66.18 IC67.18 IC68.18 IC69.18
N$402: IC66.19 IC67.19 IC68.19 IC69.19
N$403: IC66.20 IC67.20 IC68.20 IC69.20
N$404: IC66.21 IC67.21 IC68.21 IC69.21
N$405: IC66.22 IC67.22 IC68.22 IC69.22
N$406: IC66.23 IC67.23 IC68.23 IC69.23
N$407: IC66.24 IC67.24 IC68.24 IC69.24
N$408: IC70.1 IC71.1 IC72.1 IC73.1
N$409: IC70.2 IC71.2 IC72.2 IC73.2
N$410: IC70.3 IC71.3 IC72.3 IC73.3
N$411: IC70.4 IC71.4 IC72.4 IC73.4
N$412: IC70.5 IC71.5 IC72.5 IC73.5
N$413: IC70.6 IC71.6 IC72.6 IC73.6
N$414: IC70.7 IC71.7 IC72.7 IC73.7
N$415: IC70.8 IC71.8 IC72.8 IC73.8
N$416: IC70.9 IC71.9 IC72.9 IC73.9
N$417: IC70.10 IC71.10 IC72.10 IC73.10
N$418: IC70.11 IC71.11 IC72.11 IC73.11
N$419: IC70.12 IC71.12 IC72.12 IC73.12
N$420: IC70.13 IC71.13 IC72.13 IC73.13
N$421: IC70.14 IC71.14 IC72.14 IC73.14
N$422: IC70.15 IC71.15 IC72.15 IC73.15
N$423: IC70.16 IC71.16 IC72.16 IC73.16
N$424: IC70.17 IC71.17 IC72.17 IC73.17
N$425: IC70.18 IC71.18 IC72.18 IC73.18
N$426: IC70.19 IC71.19 IC72.19 IC73.19
N$427: IC70.20 IC71.20 IC72.20 IC73.20
N$428: IC70.21 IC71.21 IC72.21 IC73.21
N$429: IC70.22 IC71.22 IC72.22 IC73.22
N$430: IC70.23 IC71.23 IC72.23 IC73.23
N$431: IC70.24 IC71.24 IC72.24 IC73.24
N$432: IC74.1 IC75.1 IC76.1 IC77.1
N$433: IC74.2 IC75.2 IC76.2 IC77.2
N$434: IC74.3 IC75.3 IC76.3 IC77.3
N$435: IC74.4 IC75.4 IC76.4 IC77.4
N$436: IC74.5 IC75.5 IC76.5 IC77.5
N$437: IC74.6 IC75.6 IC76.6 IC77.6
N$438: IC74.7 IC75.7 IC76.7 IC77.7
N$439: IC74.8 IC75.8 IC76.8 IC77.8
N$440: IC74.9 IC75.9 IC76.9 IC77.9
N$441: IC74.10 IC75.10 IC76.10 IC77.10
N$442: IC74.11 IC75.11 IC76.11 IC77.11
N$443: IC74.12 IC75.12 IC76.12 IC77.12
N$444: IC74.13 IC75.13 IC76.13 IC77.13
N$445: IC74.14 IC75.14 IC76.14 IC77.14
N$446: IC74.15 IC75.15 IC76.15 IC77.15
N$447: IC74.16 IC75.16 IC76.16 IC77.16
N$448: IC74.17 IC75.17 IC76.17 IC77.17
N$449: IC74.18 IC75.18 IC76.18 IC77.18
N$450: IC74.19 IC75.19 IC76.19 IC77.19
N$451: IC74.20 IC75.20 IC76.20 IC77.20
N$452: IC74.21 IC75.21 IC76.21 IC77.21
N$453: IC74.22 IC75.22 IC76.22 IC77.22
N$454: IC74.23 IC75.23 IC76.23 IC77.23
N$455: IC74.24 IC75.24 IC76.24 IC77.24
N$456: IC78.1 IC79.1 IC80.1 IC81.1
N$457: IC78.2 IC79.2 IC80.2 IC81.2
N$458: IC78.3 IC79.3 IC80.3 IC81.3
N$459: IC78.4 IC79.4 IC80.4 IC81.4
N$460: IC78.5 IC79.5 IC80.5 IC81.5
N$461: IC78.6 IC79.6 IC80.6 IC81.6
N$462: IC78.7 IC79.7 IC80.7 IC81.7
N$463: IC78.8 IC79.8 IC80.8 IC81.8
N$464: IC78.9 IC79.9 IC80.9 IC81.9
N$465: IC78.10 IC79.10 IC80.10 IC81.10
N$466: IC78.11 IC79.11 IC80.11 IC81.11
N$467: IC78.12 IC79.12 IC80.12 IC81.12
N$468: IC78.13 IC79.13 IC80.13 IC81.13
N$469: IC78.14 IC79.14 IC80.14 IC81.14
N$470: IC78.15 IC79.15 IC80.15 IC81.15
N$471: IC78.16 IC79.16 IC80.16 IC81.16
N$472: IC78.17 IC79.17 IC80.17 IC81.17
N$473: IC78.18 IC79.18 IC80.18 IC81.18
N$474: IC78.19 IC79.19 IC80.19 IC81.19
N$475: IC78.20 IC79.20 IC80.20 IC81.20
N$476: IC78.21 IC79.21 IC80.21 IC81.21
N$477: IC78.22 IC79.22 IC80.22 IC81.22
N$478: IC78.23 IC79.23 IC80.23 IC81.23
N$479: IC78.24 IC79.24 IC80.24 IC81.24
N$480: IC82.1 IC83.1 IC84.1 IC85.1
N$481: IC82.2 IC83.2 IC84.2 IC85.2
N$482: IC82.3 IC83.3 IC84.3 IC85.3
N$483: IC82.4 IC83.4 IC84.4 IC85.4
N$484: IC82.5 IC83.5 IC84.5 IC85.5
N$485: IC82.6 IC83.6 IC84.6 IC85.6
N$486: IC82.7 IC83.7 IC84.7 IC85.7
N$487: IC82.8 IC83.8 IC84.8 IC85.8
N$488: IC82.9 IC83.9 IC84.9 IC85.9
N$489: IC82.10 IC83.10 IC84.10 IC85.10
N$490: IC82.11 IC83.11 IC84.11 IC85.11
N$491: IC82.12 IC83.12 IC84.12 IC85.12
N$492: IC82.13 IC83.13 IC84.13 IC85.13
N$493: IC82.14 IC83.14 IC84.14 IC85.14
N$494: IC82.15 IC83.15 IC84.15 IC85.15
N$495: IC82.16 IC83.16 IC84.16 IC85.16
N$496: IC82.17 IC83.17 IC84.17 IC85.17
N$497: IC82.18 IC83.18 IC84.18 IC85.18
N$498: IC82.19 IC83.19 IC84.19 IC85.19
N$499: IC82.20 IC83.20 IC84.20 IC85.20
N$500: IC82.21 IC83.21 IC84.21 IC85.21
N$501: IC82.22 IC83.22 IC84.22 IC85.22
N$502: IC82.23 IC83.23 IC84.23 IC85.23
N$503: IC82.24 IC83.24 IC84.24 IC85.24
N$504: IC86.1 IC87.1 IC88.1 IC89.1
N$505: IC86.2 IC87.2 IC88.2 IC89.2
N$506: IC86.3 IC87.3 IC88.3 IC89.3
N$507: IC86.4 IC87.4 IC88.4 IC89.4
N$508: IC86.5 IC87.5 IC88.5 IC89.5
N$509: IC86.6 IC87.6 IC88.6 IC89.6
N$510: IC86.7 IC87.7 IC88.7 IC89.7
N$511: IC86.8 IC87.8 IC88.8 IC89.8
N$512: IC86.9 IC87.9 IC88.9 IC89.9
N$513: IC86.10 IC87.10 IC88.10 IC89.10
N$514: IC86.11 IC87.11 IC88.11 IC89.11
N$515: IC86.12 IC87.12 IC88.12 IC89.12
N$516: IC86.13 IC87.13 IC88.13 IC89.13
N$517: IC86.14 IC87.14 IC88.14 IC89.14
N$518: IC86.15 IC87.15 IC88.15 IC89.15
N$519: IC86.16 IC87.16 IC88.16 IC89.16
N$520: IC86.17 IC87.17 IC88.17 IC89.17
N$521: IC86.18 IC87.18 IC88.18 IC89.18
N$522: IC86.19 IC87.19 IC88.19 IC89.19
N$523: IC86.20 IC87.20 IC88.20 IC89.20
N$524: IC86.21 IC87.21 IC88.21 IC89.21
N$525: IC86.22 IC87.22 IC88.22 IC89.22
N$526: IC86.23 IC87.23 IC88.23 IC89.23
N$527: IC86.24 IC87.24 IC88.24 IC89.24
N$528: IC90.1 IC91.1 IC92.1 IC93.1
N$529: IC90.2 IC91.2 IC92.2 IC93.2
N$530: IC90.3 IC91.3 IC92.3 IC93.3
N$531: IC90.4 IC91.4 IC92.4 IC93.4
N$532: IC90.5 IC91.5 IC92.5 IC93.5
N$533: IC90.6 IC91.6 IC92.6 IC93.6
N$534: IC90.7 IC91.7 IC92.7 IC93.7
N$535: IC90.8 IC91.8 IC92.8 IC93.8
N$536: IC90.9 IC91.9 IC92.9 IC93.9
N$537: IC90.10 IC91.10 IC92.10 IC93.10
N$538: IC90.11 IC91.11 IC92.11 IC93.11
N$539: IC90.12 IC91.12 IC92.12 IC93.12
N$540: IC90.13 IC91.13 IC92.13 IC93.13
N$541: IC90.14 IC91.14 IC92.14 IC93.14
N$542: IC90.15 IC91.15 IC92.15 IC93.15
N$543: IC90.16 IC91.16 IC92.16 IC93.16
N$544: IC90.17 IC91.17 IC92.17 IC93.17
N$545: IC90.18 IC91.18 IC92.18 IC93.18
N$546: IC90.19 IC91.19 IC92.19 IC93.19
N$547: IC90.20 IC91.20 IC92.20 IC93.20
N$548: IC90.21 IC91.21 IC92.21 IC93.21
N$549: IC90.22 IC91.22 IC92.22 IC93.22
N$550: IC90.23 IC91.23 IC92.23 IC93.23
N$551: IC90.24 IC91.24 IC92.24 IC93.24
N$552: IC94.1 IC95.1 IC96.1 IC97.1
N$553: IC94.2 IC95.2 IC96.2 IC97.2
N$554: IC94.3 IC95.3 IC96.3 IC97.3
N$555: IC94.4 IC95.4 IC96.4 IC97.4
N$556: IC94.5 IC95.5 IC96.5 IC97.5
N$557: IC94.6 IC95.6 IC96.6 IC97.6
N$558: IC94.7 IC95.7 IC96.7 IC97.7
N$559: IC94.8 IC95.8 IC96.8 IC97.8
N$560: IC94.9 IC95.9 IC96.9 IC97.9
N$561: IC94.10 IC95.10 IC96.10 IC97.10
N$562: IC94.11 IC95.11 IC96.11 IC97.11
N$563: IC94.12 IC95.12 IC96.12 IC97.12
N$564: IC94.13 IC95.13 IC96.13 IC97.13
N$565: IC94.14 IC95.14 IC96.14 IC97.14
N$566: IC94.15 IC95.15 IC96.15 IC97.15
N$567: IC94.16 IC95.16 IC96.16 IC97.16
N$568: IC94.17 IC95.17 IC96.17 IC97.17
N$569: IC94.18 IC95.18 IC96.18 IC97.18
N$570: IC94.19 IC95.19 IC96.19 IC97.19
N$571: IC94.20 IC95.20 IC96.20 IC97.20
N$572: IC94.21 IC95.21 IC96.21 IC97.21
N$573: IC94.22 IC95.22 IC96.22 IC97.22
N$574: IC94.23 IC95.23 IC96.23 IC97.23
N$575: IC94.24 IC95.24 IC96.24 IC97.24
N$576: IC98.1 IC99.1 IC100.1 IC101.1
N$577: IC98.2 IC99.2 IC100.2 IC101.2
N$578: IC98.3 IC99.3 IC100.3 IC101.3
N$579: IC98.4 IC99.4 IC100.4 IC101.4
N$580: IC98.5 IC99.5 IC100.5 IC101.5
N$581: IC98.6 IC99.6 IC100.6 IC101.6
N$582: IC98.7 IC99.7 IC100.7 IC101.7
N$583: IC98.8 IC99.8 IC100.8 IC101.8
N$584: IC98.9 IC99.9 IC100.9 IC101.9
N$585: IC98.10 IC99.10 IC100.10 IC101.10
N$586: IC98.11 IC99.11 IC100.11 IC101.11
N$587: IC98.12 IC99.12 IC100.12 IC101.12
N$588: IC98.13 IC99.13 IC100.13 IC101.13
N$589: IC98.14 IC99.14 IC100.14 IC101.14
N$590: IC98.15 IC99.15 IC100.15 IC101.15
N$591: IC98.16 IC99.16 IC100.16 IC101.16
N$592: IC98.17 IC99.17 IC100.17 IC101.17
N$593: IC98.18 IC99.18 IC100.18 IC101.18
N$594: IC98.19 IC99.19 IC100.19 IC101.19
N$595: IC98.20 IC99.20 IC100.20 IC101.20
N$596: IC98.21 IC99.21 IC100.21 IC101.21
N$597: IC98.22 IC99.22 IC100.22 IC101.22
N$598: IC98.23 IC99.23 IC100.23 IC101.23
N$599: IC98.24 IC99.24 IC100.24 IC101.24
N$600: IC102.1 IC103.1 IC104.1 IC105.1
N$601: IC102.2 IC103.2 IC104.2 IC105.2
N$602: IC102.3 IC103.3 IC104.3 IC105.3
N$603: IC102.4 IC103.4 IC104.4 IC105.4
N$604: IC102.5 IC103.5 IC104.5 IC105.5
N$605: IC102.6 IC103.6 IC104.6 IC105.6
N$606: IC102.7 IC103.7 IC104.7 IC105.7
N$607: IC102.8 IC103.8 IC104.8 IC105.8
N$608: IC102.9 IC103.9 IC104.9 IC105.9
N$609: IC102.10 IC103.10 IC104.10 IC105.10
N$610: IC102.11 IC103.11 IC104.11 IC105.11
N$611: IC102.12 IC103.12 IC104.12 IC105.12
N$612: IC102.13 IC103.13 IC104.13 IC105.13
N$613: IC102.14 IC103.14 IC104.14 IC105.14
N$614: IC102.15 IC103.15 IC104.15 IC105.15
N$615: IC102.16 IC103.16 IC104.16 IC105.16
N$616: IC102.17 IC103.17 IC104.17 IC105.17
N$617: IC102.18 IC103.18 IC104.18 IC105.18
N$618: IC102.19 IC103.19 IC104.19 IC105.19
N$619: IC102.20 IC103.20 IC104.20 IC105.20
N$620: IC102.21 IC103.21 IC104.21 IC105.21
N$621: IC102.22 IC103.22 IC104.22 IC105.22
N$622: IC102.23 IC103.23 IC104.23 IC105.23
N$623: IC102.24 IC103.24 IC104.24 IC105.24
N$624: IC106.1 IC107.1 IC108.1 IC109.1
N$625: IC106.2 IC107.2 IC108.2 IC109.2
N$626: IC106.3 IC107.3 IC108.3 IC109.3
N$627: IC106.4 IC107.4 IC108.4 IC109.4
N$628: IC106.5 IC107.5 IC108.5 IC109.5
N$629: IC106.6 IC107.6 IC108.6 IC109.6
N$630: IC106.7 IC107.7 IC108.7 IC109.7
N$631: IC106.8 IC107.8 IC108.8 IC109.8
N$632: IC106.9 IC107.9 IC108.9 IC109.9
N$633: IC106.10 IC107.10 IC108.10 IC109.10
N$634: IC106.11 IC107.11 IC108.11 IC109.11
N$635: IC106.12 IC107.12 IC108.12 IC109.12
N$636: IC106.13 IC107.13 IC108.13 IC109.13
N$637: IC106.14 IC107.14 IC108.14 IC109.14
N$638: IC106.15 IC107.15 IC108.15 IC109.15
N$639: IC106.16 IC107.16 IC108.16 IC109.16
N$640: IC106.17 IC107.17 IC108.17 IC109.17
N$641: IC106.18 IC107.18 IC108.18 IC109.18
N$642: IC106.19 IC107.19 IC108.19 IC109.19
N$643: IC106.20 IC107.20 IC108.20 IC109.20
N$644: IC106.21 IC107.21 IC108.21 IC109.21
N$645: IC106.22 IC107.22 IC108.22 IC109.22
N$646: IC106.23 IC107.23 IC108.23 IC109.23
N$647: IC106.24 IC107.24 IC108.24 IC109.24
N$648: IC110.1 IC111.1 IC112.1 IC113.1
N$649: IC110.2 IC111.2 IC112.2 IC113.2
N$650: IC110.3 IC111.3 IC112.3 IC113.3
N$651: IC110.4 IC111.4 IC112.4 IC113.4
N$652: IC110.5 IC111.5 IC112.5 IC113.5
N$653: IC110.6 IC111.6 IC112.6 IC113.6
N$654: IC110.7 IC111.7 IC112.7 IC113.7
N$655: IC110.8 IC111.8 IC112.8 IC113.8
N$656: IC110.9 IC111.9 IC112.9 IC113.9
N$657: IC110.10 IC111.10 IC112.10 IC113.10
N$658: IC110.11 IC111.11 IC112.11 IC113.11
N$659: IC110.12 IC111.12 IC112.12 IC113.12
N$660: IC110.13 IC111.13 IC112.13 IC113.13
N$661: IC110.14 IC111.14 IC112.14 IC113.14
N$662: IC110.15 IC111.15 IC112.15 IC113.15
N$663: IC110.16 IC111.16 IC112.16 IC113.16
N$664: IC110.17 IC111.17 IC112.17 IC113.17
N$665: IC110.18 IC111.18 IC112.18 IC113.18
N$666: IC110.19 IC111.19 IC112.19 IC113.19
N$667: IC110.20 IC111.20 IC112.20 IC113.20
N$668: IC110.21 IC111.21 IC112.21 IC113.21
N$669: IC110.22 IC111.22 IC112.22 IC113.22
N$670: IC110.23 IC111.23 IC112.23 IC113.23
N$671: IC110.24 IC111.24 IC112.24 IC113.24
N$672: IC114.1 IC115.1 IC116.1 IC117.1
N$673: IC114.2 IC115.2 IC116.2 IC117.2
N$674: IC114.3 IC115.3 IC116.3 IC117.3
N$675: IC114.4 IC115.4 IC116.4 IC117.4
N$676: IC114.5 IC115.5 IC116.5 IC117.5
N$677: IC114.6 IC115.6 IC116.6 IC117.6
N$678: IC114.7 IC115.7 IC116.7 IC117.7
N$679: IC114.8 IC115.8 IC116.8 IC117.8
N$680: IC114.9 IC115.9 IC116.9 IC117.9
N$681: IC114.10 IC115.10 IC116.10 IC117.10
N$682: IC114.11 IC115.11 IC116.11 IC117.11
N$683: IC114.12 IC115.12 IC116.12 IC117.12
N$684: IC114.13 IC115.13 IC116.13 IC117.13
N$685: IC114.14 IC115.14 IC116.14 IC117.14
N$686: IC114.15 IC115.15 IC116.15 IC117.15
N$687: IC114.16 IC115.16 IC116.16 IC117.16
N$688: IC114.17 IC115.17 IC116.17 IC117.17
N$689: IC114.18 IC115.18 IC116.18 IC117.18
N$690: IC114.19 IC115.19 IC116.19 IC117.19
N$691: IC114.20 IC115.20 IC116.20 IC117.20
N$692: IC114.21 IC115.21 IC116.21 IC117.21
N$693: IC114.22 IC115.22 IC116.22 IC117.22
N$694: IC114.23 IC115.23 IC116.23 IC117.23
N$695: IC114.24 IC115.24 IC116.24 IC117.24
N$696: IC118.1 IC119.1 IC120.1 IC121.1
N$697: IC118.2 IC119.2 IC120.2 IC121.2
N$698: IC118.3 IC119.3 IC120.3 IC121.3
N$699: IC118.4 IC119.4 IC120.4 IC121.4
N$700: IC118.5 IC119.5 IC120.5 IC121.5
N$701: IC118.6 IC119.6 IC120.6 IC121.6
N$702: IC118.7 IC119.7 IC120.7 IC121.7
N$703: IC118.8 IC119.8 IC120.8 IC121.8
N$704: IC118.9 IC119.9 IC120.9 IC121.9
N$705: IC118.10 IC119.10 IC120.10 IC121.10
N$706: IC118.11 IC119.11 IC120.11 IC121.11
N$707: IC118.12 IC119.12 IC120.12 IC121.12
N$708: IC118.13 IC119.13 IC120.13 IC121.13
N$709: IC118.14 IC119.14 IC120.14 IC121.14
N$710: IC118.15 IC119.15 IC120.15 IC121.15
N$711: IC118.16 IC119.16 IC120.16 IC121.16
N$712: IC118.17 IC119.17 IC120.17 IC121.17
N$713: IC118.18 IC119.18 IC120.18 IC121.18
N$714: IC118.19 IC119.19 IC120.19 IC121.19
N$715: IC118.20 IC119.20 IC120.20 IC121.20
N$716: IC118.21 IC119.21 IC120.21 IC121.21
N$717: IC118.22 IC119.22 IC120.22 IC121.22
N$718: IC118.23 IC119.23 IC120.23 IC121.23
N$719: IC118.24 IC119.24 IC120.24 IC121.24
N$720: IC122.1 IC123.1 IC124.1 IC125.1
N$721: IC122.2 IC123.2 IC124.2 IC125.2
N$722: IC122.3 IC123.3 IC124.3 IC125.3
N$723: IC122.4 IC123.4 IC124.4 IC125.4
N$724: IC122.5 IC123.5 IC124.5 IC125.5
N$725: IC122.6 IC123.6 IC124.6 IC125.6
N$726: IC122.7 IC123.7 IC124.7 IC125.7
N$727: IC122.8 IC123.8 IC124.8 IC125.8
N$728: IC122.9 IC123.9 IC124.9 IC125.9
N$729: IC122.10 IC123.10 IC124.10 IC125.10
N$730: IC122.11 IC123.11 IC124.11 IC125.11
N$731: IC122.12 IC123.12 IC124.12 IC125.12
N$732: IC122.13 IC123.13 IC124.13 IC125.13
N$733: IC122.14 IC123.14 IC124.14 IC125.14
N$734: IC122.15 IC123.15 IC124.15 IC125.15
N$735: IC122.16 IC123.16 IC124.16 IC125.16
N$736: IC122.17 IC123.17 IC124.17 IC125.17
N$737: IC122.18 IC123.18 IC124.18 IC125.18
N$738: IC122.19 IC123.19 IC124.19 IC125.19
N$739: IC122.20 IC123.20 IC124.20 IC125.20
N$740: IC122.21 IC123.21 IC124.21 IC125.21
N$741: IC122.22 IC123.22 IC124.22 IC125.22
N$742: IC122.23 IC123.23 IC124.23 IC125.23
N$743: IC122.24 IC123.24 IC124.24 IC125.24
N$744: IC126.1 IC127.1 IC128.1 IC129.1
N$745: IC126.2 IC127.2 IC128.2 IC129.2
N$746: IC126.3 IC127.3 IC128.3 IC129.3
N$747: IC126.4 IC127.4 IC128.4 IC129.4
N$748: IC126.5 IC127.5 IC128.5 IC129.5
N$749: IC126.6 IC127.6 IC128.6 IC129.6
N$750: IC126.7 IC127.7 IC128.7 IC129.7
N$751: IC126.8 IC127.8 IC128.8 IC129.8
N$752: IC126.9 IC127.9 IC128.9 IC129.9
N$753: IC126.10 IC127.10 IC128.10 IC129.10
N$754: IC126.11 IC127.11 IC128.11 IC129.11
N$755: IC126.12 IC127.12 IC128.12 IC129.12
N$756: IC126.13 IC127.13 IC128.13 IC129.13
N$757: IC126.14 IC127.14 IC128.14 IC129.14
N$758: IC126.15 IC127.15 IC128.15 IC129.15
N$759: IC126.16 IC127.16 IC128.16 IC129.16
N$760: IC126.17 IC127.17 IC128.17 IC129.17
N$761: IC126.18 IC127.18 IC128.18 IC129.18
N$762: IC126.19 IC127.19 IC128.19 IC129.19
N$763: IC126.20 IC127.20 IC128.20 IC129.20
N$764: IC126.21 IC127.21 IC128.21 IC129.21
N$765: IC126.22 IC127.22 IC128.22 IC129.22
N$766: IC126.23 IC127.23 IC128.23 IC129.23
N$767: IC126.24 IC127.24 IC128.24 IC129.24
N$768: IC130.1 IC131.1 IC132.1 IC133.1
N$769: IC130.2 IC131.2 IC132.2 IC133.2
N$770: IC130.3 IC131.3 IC132.3 IC133.3
N$771: IC130.4 IC131.4 IC132.4 IC133.4
N$772: IC130.5 IC131.5 IC132.5 IC133.5
N$773: IC130.6 IC131.6 IC132.6 IC133.6
N$774: IC130.7 IC131.7 IC132.7 IC133.7
N$775: IC130.8 IC131.8 IC132.8 IC133.8
N$776: IC130.9 IC131.9 IC132.9 IC133.9
N$777: IC130.10 IC131.10 IC132.10 IC133.10
N$778: IC130.11 IC131.11 IC132.11 IC133.11
N$779: IC130.12 IC131.12 IC132.12 IC133.12
N$780: IC130.13 IC131.13 IC132.13 IC133.13
N$781: IC130.14 IC131.14 IC132.14 IC133.14
N$782: IC130.15 IC131.15 IC132.15 IC133.15
N$783: IC130.16 IC131.16 IC132.16 IC133.16
N$784: IC130.17 IC131.17 IC132.17 IC133.17
N$785: IC130.18 IC131.18 IC132.18 IC133.18
N$786: IC130.19 IC131.19 IC132.19 IC133.19
N$787: IC130.20 IC131.20 IC132.20 IC133.20
N$788: IC130.21 IC131.21 IC132.21 IC133.21
N$789: IC130.22 IC131.22 IC132.22 IC133.22
N$790: IC130.23 IC131.23 IC132.23 IC133.23
N$791: IC130.24 IC131.24 IC132.24 IC133.24
N$792: IC134.1 IC135.1 IC136.1 IC137.1
N$793: IC134.2 IC135.2 IC136.2 IC137.2
N$794: IC134.3 IC135.3 IC136.3 IC137.3
N$795: IC134.4 IC135.4 IC136.4 IC137.4
N$796: IC134.5 IC135.5 IC136.5 IC137.5
N$797: IC134.6 IC135.6 IC136.6 IC137.6
N$798: IC134.7 IC135.7 IC136.7 IC137.7
N$799: IC134.8 IC135.8 IC136.8 IC137.8
N$800: IC134.9 IC135.9 IC136.9 IC137.9
N$801: IC134.10 IC135.10 IC136.10 IC137.10
N$802: IC134.11 IC135.11 IC136.11 IC137.11
N$803: IC134.12 IC135.12 IC136.12 IC137.12
N$804: IC134.13 IC135.13 IC136.13 IC137.13
N$805: IC134.14 IC135.14 IC136.14 IC137.14
N$806: IC134.15 IC135.15 IC136.15 IC137.15
N$807: IC134.16 IC135.16 IC136.16 IC137.16
N$808: IC134.17 IC135.17 IC136.17 IC137.17
N$809: IC134.18 IC135.18 IC136.18 IC137.18
N$810: IC134.19 IC135.19 IC136.19 IC137.19
N$811: IC134.20 IC135.20 IC136.20 IC137.20
N$812: IC134.21 IC135.21 IC136.21 IC137.21
N$813: IC134.22 IC135.22 IC136.22 IC137.22
N$814: IC134.23 IC135.23 IC136.23 IC137.23
N$815: IC134.24 IC135.24 IC136.24 IC137.24
N$816: IC138.1 IC139.1 IC140.1 IC141.1
N$817: IC138.2 IC139.2 IC140.2 IC141.2
N$818: IC138.3 IC139.3 IC140.3 IC141.3
N$819: IC138.4 IC139.4 IC140.4 IC141.4
N$820: IC138.5 IC139.5 IC140.5 IC141.5
N$821: IC138.6 IC139.6 IC140.6 IC141.6
N$822: IC138.7 IC139.7 IC140.7 IC141.7
N$823: IC138.8 IC139.8 IC140.8 IC141.8
N$824: IC138.9 IC139.9 IC140.9 IC141.9
N$825: IC138.10 IC139.10 IC140.10 IC141.10
N$826: IC138.11 IC139.11 IC140.11 IC141.11
N$828: IC138.12 IC139.12 IC140.12 IC141.12
N$829: IC138.13 IC139.13 IC140.13 IC141.13
N$830: IC138.14 IC139.14 IC140.14 IC141.14
N$831: IC138.15 IC139.15 IC140.15 IC141.15
N$832: IC138.16 IC139.16 IC140.16 IC141.16
N$833: IC138.17 IC139.17 IC140.17 IC141.17
N$835: IC138.18 IC139.18 IC140.18 IC141.18
N$836: IC138.19 IC139.19 IC140.19 IC141.19
N$837: IC138.20 IC139.20 IC140.20 IC141.20
N$838: IC138.21 IC139.21 IC140.21 IC141.21
N$839: IC138.22 IC139.22 IC140.22 IC141.22
N$840: IC138.23 IC139.23 IC140.23 IC141.23
N$841: IC138.24 IC139.24 IC140.24 IC141.24
N$842: IC142.1 IC143.1 IC144.1 IC145.1
N$843: IC142.2 IC143.2 IC144.2 IC145.2
N$844: IC142.3 IC143.3 IC144.3 IC145.3
N$845: IC142.4 IC143.4 IC144.4 IC145.4
N$846: IC142.5 IC143.5 IC144.5 IC145.5
N$847: IC142.6 IC143.6 IC144.6 IC145.6
N$848: IC142.7 IC143.7 IC144.7 IC145.7
N$849: IC142.8 IC143.8 IC144.8 IC145.8
N$850: IC142.9 IC143.9 IC144.9 IC145.9
N$851: IC142.10 IC143.10 IC144.10 IC145.10
N$852: IC142.11 IC143.11 IC144.11 IC145.11
N$853: IC142.12 IC143.12 IC144.12 IC145.12
N$854: IC142.13 IC143.13 IC144.13 IC145.13
N$855: IC142.14 IC143.14 IC144.14 IC145.14
N$856: IC142.15 IC143.15 IC144.15 IC145.15
N$857: IC142.16 IC143.16 IC144.16 IC145.16
N$858: IC142.17 IC143.17 IC144.17 IC145.17
N$859: IC142.18 IC143.18 IC144.18 IC145.18
N$860: IC142.19 IC143.19 IC144.19 IC145.19
N$861: IC142.20 IC143.20 IC144.20 IC145.20
N$862: IC142.21 IC143.21 IC144.21 IC145.21
N$863: IC142.22 IC143.22 IC144.22 IC145.22
N$864: IC142.23 IC143.23 IC144.23 IC145.23
N$865: IC142.24 IC143.24 IC144.24 IC145.24
N$866: IC146.1 IC147.1 IC148.1 IC149.1
N$867: IC146.2 IC147.2 IC148.2 IC149.2
N$868: IC146.3 IC147.3 IC148.3 IC149.3
N$869: IC146.4 IC147.4 IC148.4 IC149.4
N$870: IC146.5 IC147.5 IC148.5 IC149.5
N$871: IC146.6 IC147.6 IC148.6 IC149.6
N$872: IC146.7 IC147.7 IC148.7 IC149.7
N$873: IC146.8 IC147.8 IC148.8 IC149.8
N$874: IC146.9 IC147.9 IC148.9 IC149.9
N$875: IC146.10 IC147.10 IC148.10 IC149.10
N$876: IC146.11 IC147.11 IC148.11 IC149.11
N$877: IC146.12 IC147.12 IC148.12 IC149.12
N$878: IC146.13 IC147.13 IC148.13 IC149.13
N$879: IC146.14 IC147.14 IC148.14 IC149.14
N$880: IC146.15 IC147.15 IC148.15 IC149.15
N$881: IC146.16 IC147.16 IC148.16 IC149.16
N$882: IC146.17 IC147.17 IC148.17 IC149.17
N$883: IC146.18 IC147.18 IC148.18 IC149.18
N$884: IC146.19 IC147.19 IC148.19 IC149.19
N$885: IC146.20 IC147.20 IC148.20 IC149.20
N$886: IC146.21 IC147.21 IC148.21 IC149.21
N$887: IC146.22 IC147.22 IC148.22 IC149.22
N$888: IC146.23 IC147.23 IC148.23 IC149.23
N$889: IC146.24 IC147.24 IC148.24 IC149.24
N$890: IC150.1 IC151.1 IC152.1 IC153.1
N$891: IC150.2 IC151.2 IC152.2 IC153.2
N$892: IC150.3 IC151.3 IC152.3 IC153.3
N$893: IC150.4 IC151.4 IC152.4 IC153.4
N$894: IC150.5 IC151.5 IC152.5 IC153.5
N$895: IC150.6 IC151.6 IC152.6 IC153.6
N$896: IC150.7 IC151.7 IC152.7 IC153.7
N$897: IC150.8 IC151.8 IC152.8 IC153.8
N$898: IC150.9 IC151.9 IC152.9 IC153.9
N$899: IC150.10 IC151.10 IC152.10 IC153.10
N$900: IC150.11 IC151.11 IC152.11 IC153.11
N$901: IC150.12 IC151.12 IC152.12 IC153.12
N$902: IC150.13 IC151.13 IC152.13 IC153.13
N$903: IC150.14 IC151.14 IC152.14 IC153.14
N$904: IC150.15 IC151.15 IC152.15 IC153.15
N$905: IC150.16 IC151.16 IC152.16 IC153.16
N$906: IC150.17 IC151.17 IC152.17 IC153.17
N$907: IC150.18 IC151.18 IC152.18 IC153.18
N$908: IC150.19 IC151.19 IC152.19 IC153.19
N$909: IC150.20 IC151.20 IC152.20 IC153.20
N$910: IC150.21 IC151.21 IC152.21 IC153.21
N$911: IC150.22 IC151.22 IC152.22 IC153.22
N$912: IC150.23 IC151.23 IC152.23 IC153.23
N$913: IC150.24 IC151.24 IC152.24 IC153.24
VCC [supply]: SV1.1 SV1.2 SV1.3 SV1.4 SV1.5 SV1.6 SV1.7 SV1.8 SV1.9 SV1.10 SV1.11 SV1.12 SV3.1 SV3.2 SV3.3 SV3.4 SV3.5 SV3.6 SV3.7 SV3.8 SV3.9 SV3.10 SV3.11 SV3.12 SV5.1 SV5.2 SV5.3 SV5.4 SV5.5 SV5.6 SV5.7 SV5.8 SV5.9 SV5.10 SV5.11 SV5.12 SV7.1 SV7.2 SV7.3 SV7.4 SV7.5 SV7.6 SV7.7 SV7.8 SV7.9 SV7.10 SV7.11 SV7.12 SV9.1 SV9.2 SV9.3 SV9.4 SV9.5 SV9.6 SV9.7 SV9.8 SV9.9 SV9.10 SV9.11 SV9.12 SV11.1 SV11.2 SV11.3 SV11.4 SV11.5 SV11.6 SV11.7 SV11.8 SV11.9 SV11.10 SV11.11 SV11.12 SV13.1 SV13.2 SV13.3 SV13.4 SV13.5 SV13.6 SV13.7 SV13.8 SV13.9 SV13.10 SV13.11 SV13.12 SV15.1 SV15.2 SV15.3 SV15.4 SV15.5 SV15.6 SV15.7 SV15.8 SV15.9 SV15.10 SV15.11 SV15.12 SV17.1 SV17.2 SV17.3 SV17.4 SV17.5 SV17.6 SV17.7 SV17.8 SV17.9 SV17.10 SV17.11 SV17.12 SV19.1 SV19.2 SV19.3 SV19.4 SV19.5 SV19.6 SV19.7 SV19.8 SV19.9 SV19.10 SV19.11 SV19.12 SV21.1 SV21.2 SV21.3 SV21.4 SV21.5 SV21.6 SV21.7 SV21.8 SV21.9 SV21.10 SV21.11 SV21.12 SV23.1 SV23.2 SV23.3 SV23.4 SV23.5 SV23.6 SV23.7 SV23.8 SV23.9 SV23.10 SV23.11 SV23.12 SV25.1 SV25.2 SV25.3 SV25.4 SV25.5 SV25.6 SV25.7 SV25.8 SV25.9 SV25.10 SV25.11 SV25.12 SV27.1 SV27.2 SV27.3 SV27.4 SV27.5 SV27.6 SV27.7 SV27.8 SV27.9 SV27.10 SV27.11 SV27.12 SV29.1 SV29.2 SV29.3 SV29.4 SV29.5 SV29.6 SV29.7 SV29.8 SV29.9 SV29.10 SV29.11 SV29.12 SV31.1 SV31.2 SV31.3 SV31.4 SV31.5 SV31.6 SV31.7 SV31.8 SV31.9 SV31.10 SV31.11 SV31.12 SV33.1 SV33.2 SV33.3 SV33.4 SV33.5 SV33.6 SV33.7 SV33.8 SV33.9 SV33.10 SV33.11 SV33.12 SV35.1 SV35.2 SV35.3 SV35.4 SV35.5 SV35.6 SV35.7 SV35.8 SV35.9 SV35.10 SV35.11 SV35.12 SV37.1 SV37.2 SV37.3 SV37.4 SV37.5 SV37.6 SV37.7 SV37.8 SV37.9 SV37.10 SV37.11 SV37.12 SV39.1 SV39.2 SV39.3 SV39.4 SV39.5 SV39.6 SV39.7 SV39.8 SV39.9 SV39.10 SV39.11 SV39.12 SV41.1 SV41.2 SV41.3 SV41.4 SV41.5 SV41.6 SV41.7 SV41.8 SV41.9 SV41.10 SV41.11 SV41.12 SV43.1 SV43.2 SV43.3 SV43.4 SV43.5 SV43.6 SV43.7 SV43.8 SV43.9 SV43.10 SV43.11 SV43.12 SV45.1 SV45.2 SV45.3 SV45.4 SV45.5 SV45.6 SV45.7 SV45.8 SV45.9 SV45.10 SV45.11 SV45.12 SV47.1 SV47.2 SV47.3 SV47.4 SV47.5 SV47.6 SV47.7 SV47.8 SV47.9 SV47.10 SV47.11 SV47.12 SV49.1 SV49.2 SV49.3 SV49.4 SV49.5 SV49.6 SV49.7 SV49.8 SV49.9 SV49.10 SV49.11 SV49.12 SV51.1 SV51.2 SV51.3 SV51.4 SV51.5 SV51.6 SV51.7 SV51.8 SV51.9 SV51.10 SV51.11 SV51.12 SV53.1 SV53.2 SV53.3 SV53.4 SV53.5 SV53.6 SV53.7 SV53.8 SV53.9 SV53.10 SV53.11 SV53.12 SV55.1 SV55.2 SV55.3 SV55.4 SV55.5 SV55.6 SV55.7 SV55.8 SV55.9 SV55.10 SV55.11 SV55.12 SV57.1 SV57.2 SV57.3 SV57.4 SV57.5 SV57.6 SV57.7 SV57.8 SV57.9 SV57.10 SV57.11 SV57.12 SV59.1 SV59.2 SV59.3 SV59.4 SV59.5 SV59.6 SV59.7 SV59.8 SV59.9 SV59.10 SV59.11 SV59.12 SV61.1 SV61.2 SV61.3 SV61.4 SV61.5 SV61.6 SV61.7 SV61.8 SV61.9 SV61.10 SV61.11 SV61.12 SV183.1 SV183.2 SV183.3 SV183.4 SV183.5 SV183.6 SV183.7 SV183.8 SV183.9 SV183.10 SV183.11 SV183.12 SV185.1 SV185.2 SV185.3 SV185.4 SV185.5 SV185.6 SV185.7 SV185.8 SV185.9 SV185.10 SV185.11 SV185.12 SV187.1 SV187.2 SV187.3 SV187.4 SV187.5 SV187.6 SV187.7 SV187.8 SV187.9 SV187.10 SV187.11 SV187.12 SV189.1 SV189.2 SV189.3 SV189.4 SV189.5 SV189.6 SV189.7 SV189.8 SV189.9 SV189.10 SV189.11 SV189.12 SV191.1 SV191.2 SV191.3 SV191.4 SV191.5 SV191.6 SV191.7 SV191.8 SV191.9 SV191.10 SV191.11 SV191.12 ; also sheet 1,2

### Notes on the sheet
- General Prototyping Areas
- 1

## Power pins joined to a net without a drawn wire
GND: IC1.10(GND) IC2.10(GND) IC5.8(GND) IC6.7(GND) IC7.7(P:GND) IC8.7(P:GND) IC9.7(P:GND)
VCC: IC1.20(VCC) IC2.20(VCC) IC5.16(VCC) IC6.14(VCC) IC7.14(P:VCC) IC8.14(P:VCC) IC9.14(P:VCC) IC154.32(VCC) IC155.32(VCC)
VSS: IC154.16(VSS) IC155.16(VSS)

## Library data of the parts
B1 = battery:B2430UNI: LI BATTERY
C1-C9 C11 = rcl:C-US: CAPACITOR, American symbol
C10 = dec-con:CPOL-USE20-8AXIAL: A 0.8 inch electrolytic.
D1 D2 = diode:BAT19: DIODE barrier diode
D7-D14 = dec-con:MA18-1
IC1 IC2 = 74xx-us:74*245: Octal BUS TRANSCEIVER, 3-state
IC3 IC4 = memory-hitachi:58C256P: MEMORY; MPN: HN58C256AP85E; OC_FARNELL: 1496447; OC_NEWARK: 61M6616
IC5 = 74xx-us:74*138: 3-line to 8-line DECODER/DEMULTIPLEXER
IC6 = 74xx-us:74*30: 8-input NAND gate
IC7 = 74xx-us:74*10: Triple 3-input NAND gate
IC8 = 74xx-us:74*14: Hex schmitt trigger INVERTER
IC9 = 74xx-us:74*74: Dual D type positive edge triggered FLIP FLOP, preset and clear
IC10-IC153 = ic-package:DIL24: Dual In Line
IC154 IC155 = memory-hitachi:628128P: MEMORY; OC_FARNELL: unknown; OC_NEWARK: unknown
Q1 = transistor:2N3904: NPN TRANSISTOR
R1-R4 R6 R7 = rcl:R-US_: RESISTOR, American symbol
R5 = resistor-dil:8R-P: DIL RESISTOR; OC_FARNELL: unknown; OC_NEWARK: unknown
S1 = special:SW_DIP-8: DIP SWITCH
SV1-SV62 SV183-SV192 = con-lstb:MA12-1: PIN HEADER; OC_FARNELL: unknown; OC_NEWARK: unknown
U$1 = dec-con:OUTLINE-*: Board outlines for DEC boards.
U$2 = dec-con:QUAD: Quad-Height DEC board

## Net classes
1 supply: width 0.813 mm